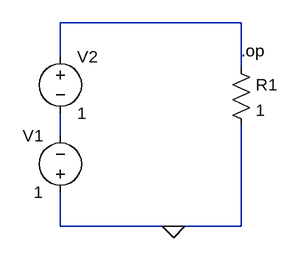
[diagram p0: schematic SeriesVsourcebotflip_R.asc]
SeriesVsourcebotflip_R.asc, the LTspice schematic file:
Version 4
SHEET 1 880 680
WIRE 384 128 128 128
WIRE 128 176 128 128
WIRE 384 192 384 128
WIRE 128 288 128 256
WIRE 128 416 128 368
WIRE 288 416 128 416
WIRE 384 416 384 272
WIRE 384 416 288 416
FLAG 288 416 0
SYMBOL voltage 128 384 R180
WINDOW 0 24 96 Left 2
WINDOW 3 24 16 Left 2
SYMATTR InstName V1
SYMATTR Value 1
SYMBOL voltage 128 160 R0
SYMATTR InstName V2
SYMATTR Value 1
SYMBOL res 368 176 R0
SYMATTR InstName R1
SYMATTR Value 1
TEXT 384 168 Left 2 !.op

The netlist it stands for:
* SeriesVsourcebotflip_R.asc
V1 0 N002 1
V2 N001 N002 1
R1 N001 0 1
.op
.backanno
.end